# Altium schematic sheet ArduinoUno_implement.SchDoc
size 209 x 148 mm
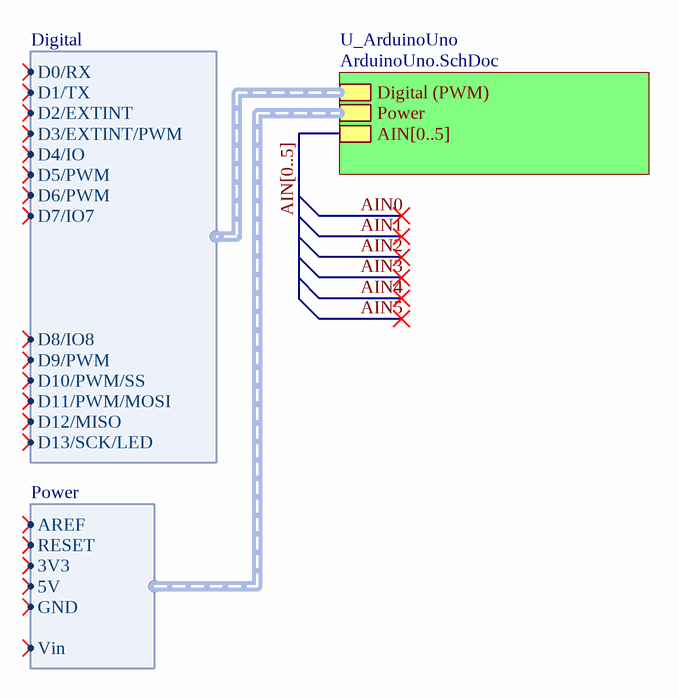
[diagram p0: ArduinoUno_implement.SchDoc]

## Sub-sheets
U_ArduinoUno = ArduinoUno.SchDoc: Digital (PWM) (harness Digital), Power (harness Power), AIN[0..5]

## Harnesses
Power: RESET, 3V3, 5V, GND, Vin, AREF
Digital: D0/RX, D1/TX, D2/EXTINT, D3/EXTINT/PWM, D4/IO, D5/PWM, D6/PWM, D7/IO7, D9/PWM, D10/PWM/SS, D11/PWM/MOSI, D12/MISO, D13/SCK/LED, D8/IO8

## Buses and harness runs
bus AIN[0..5] = sheet U_ArduinoUno/AIN[0..5]

## Notes on the sheet
- Title:
- Doc. Name:
- Variant:
- PCB Nr.:
- Rev.:
- Date:
- Drawn by:
- Sheet:
- of